# Altium schematic sheet AD8349.SchDoc
size A1
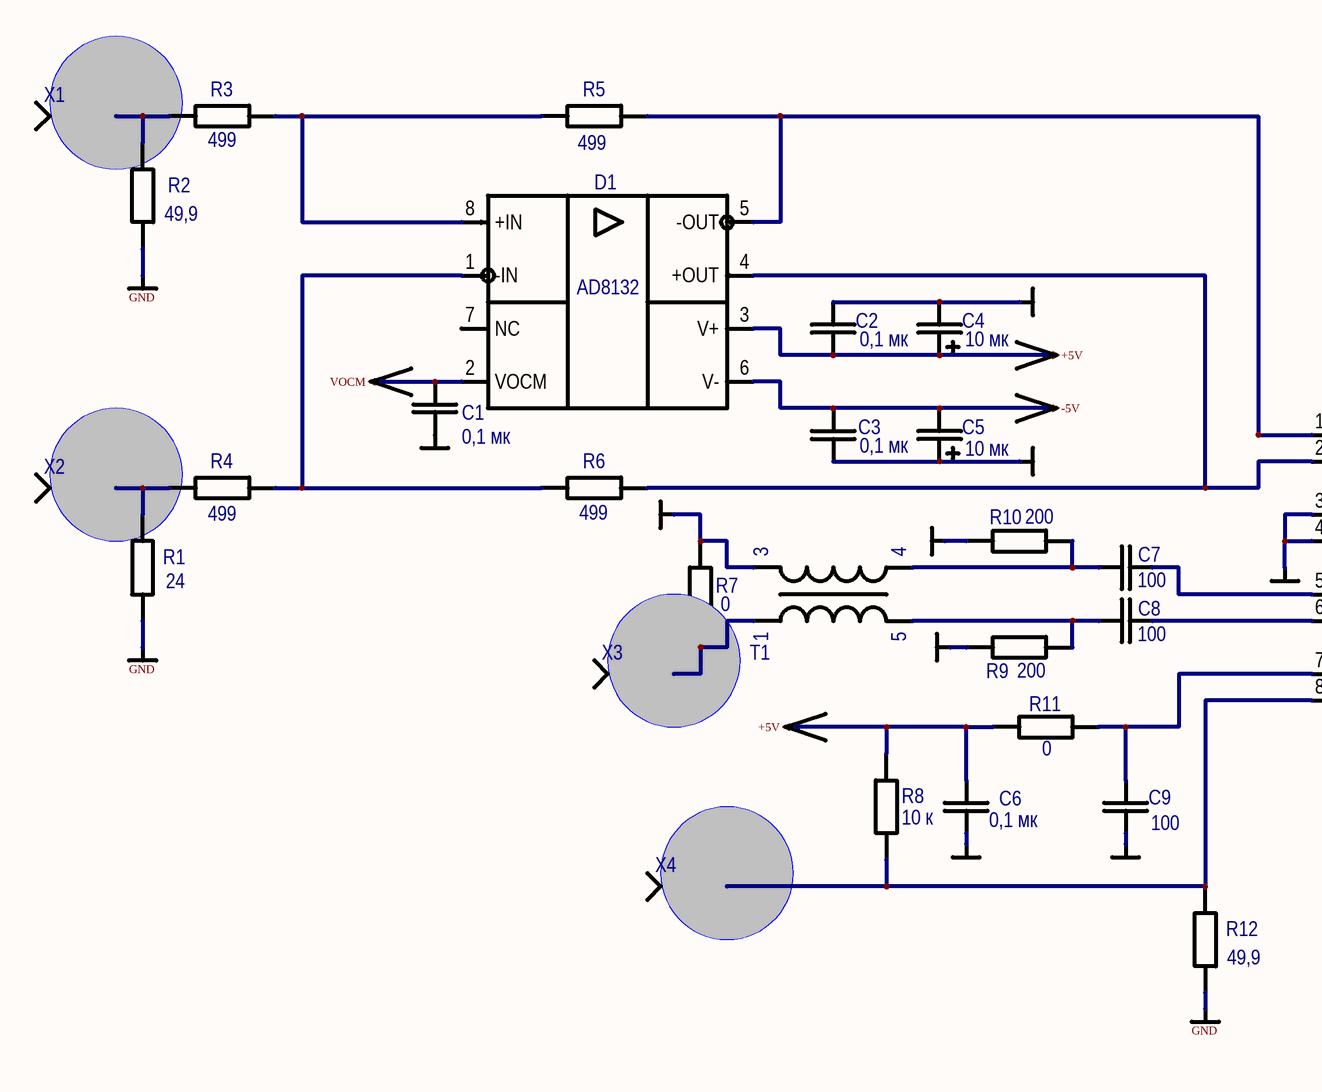
[diagram p0: AD8349.SchDoc, left]
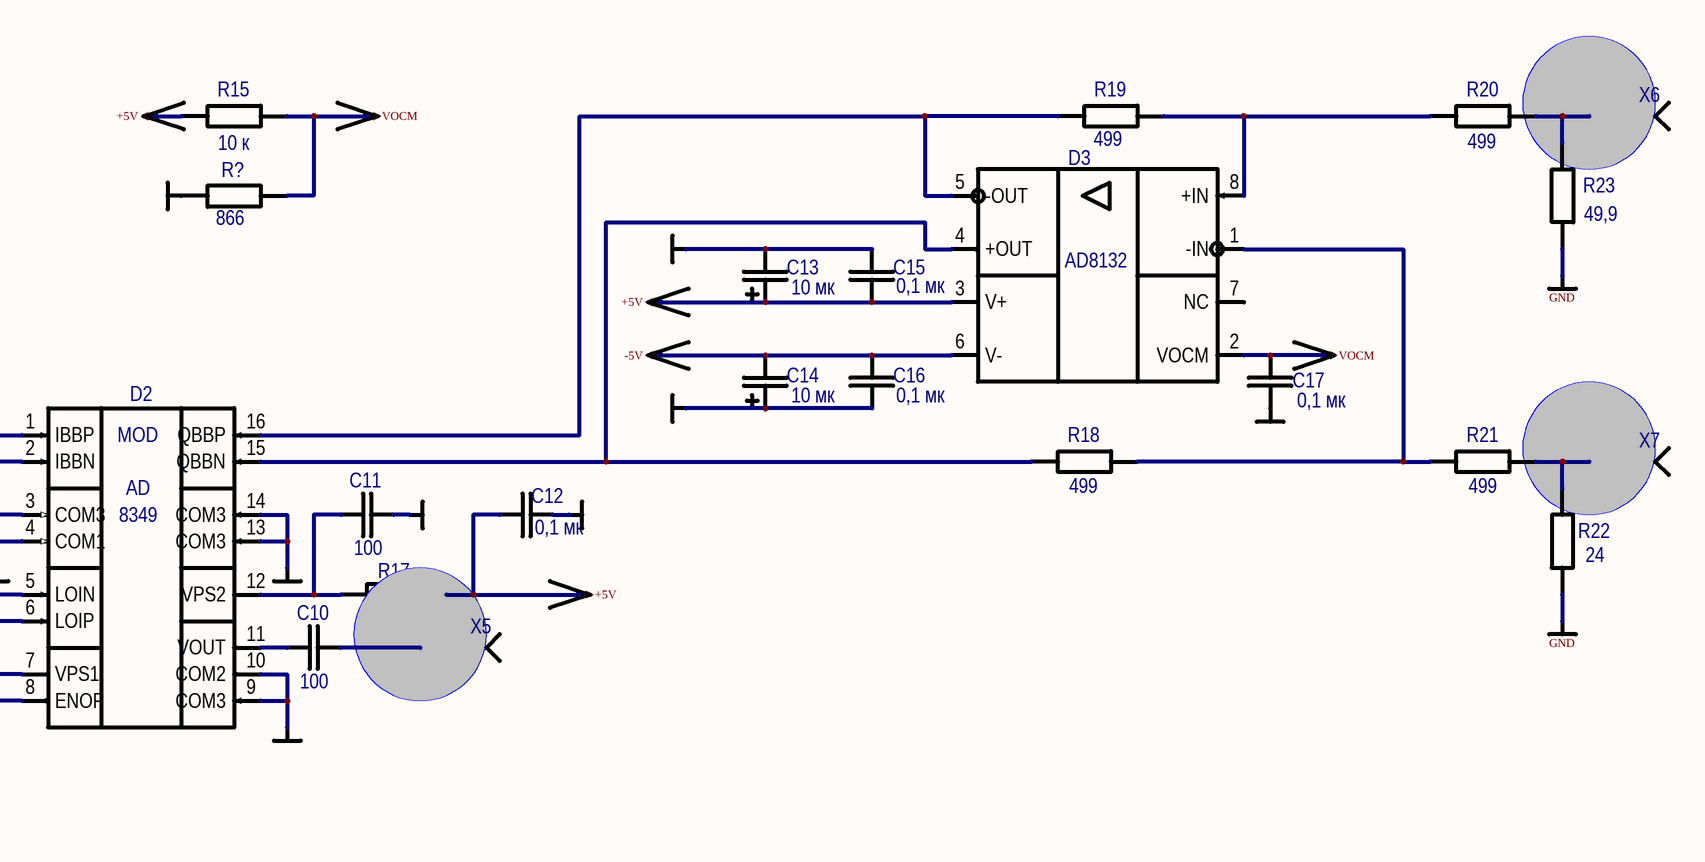
[diagram p1: AD8349.SchDoc, right]

## Parts
(Parts that share a designator on the sheet are numbered #1, #2 ... from top to bottom, then left to right.)
*  GND  (value not drawn)  (graphical)
*?#1  VCC  (value not drawn)  (graphical)
*?#2  VCC  (value not drawn)  (graphical)
*?#3  GND  (value not drawn)  (graphical)
*?#4  GND  (value not drawn)  (graphical)
*?#5  GND  (value not drawn)  (graphical)
*?#6  GND  (value not drawn)  (graphical)
*?#7  VCC  (value not drawn)  (graphical)
*?#8  VCC  (value not drawn)  (graphical)
*?#9  VCC  (value not drawn)  (graphical)
*?#10  VCC  (value not drawn)  (graphical)
*?#11  VCC  (value not drawn)  (graphical)
*?#12  VCC  (value not drawn)  (graphical)
*?#13  GND  (value not drawn)  (graphical)
*?#14  GND  (value not drawn)  (graphical)
*?#15  GND  (value not drawn)  (graphical)
*?#16  GND  (value not drawn)  (graphical)
*?#17  GND  (value not drawn)  (graphical)
*?#18  GND  (value not drawn)  (graphical)
*?#19  GND  (value not drawn)  (graphical)
*?#20  GND  (value not drawn)  (graphical)
*?#21  GND  (value not drawn)  (graphical)
*?#22  GND  (value not drawn)  (graphical)
*?#23  VCC  (value not drawn)  (graphical)
*?#24  GND  (value not drawn)  (graphical)
*?#25  GND  (value not drawn)  (graphical)
*?#26  GND  (value not drawn)  (graphical)
*?#27  VCC  (value not drawn)  (graphical)
*?#28  GND  (value not drawn)  (graphical)
*?#29  GND  (value not drawn)  (graphical)
*?#30  GND  (value not drawn)  (graphical)
*?#31  GND  (value not drawn)  (graphical)
C1  0,1 мк  [CAPC1005L]
C2  0,1 мк  [CAPC1005L]
C3  0,1 мк  [CAPC1005L]
C4  10 мк  [TC3528-1411]
C5  10 мк  [TC3528-1411]
C6  0,1 мк  [CAPC1005L]
C7  100  [CAPC1005L]
C8  100  [CAPC1005L]
C9  100  [CAPC1005L]
C10  100  [CAPC1005L]
C11  100  [CAPC1005L]
C12  0,1 мк  [CAPC1005L]
C13  10 мк  [TC3528-1411]
C14  10 мк  [TC3528-1411]
C15  0,1 мк  [CAPC1005L]
C16  0,1 мк  [CAPC1005L]
C17  0,1 мк  [CAPC1005L]
D1  AD8132  [SOIC127P600X196-8N]  (value not drawn)
D2  AD8349  [SOIC127P600X175-16N]  (value not drawn)
D3  AD8132  [SOIC127P600X196-8N]  (value not drawn)
R1  24  [RESC1005L]
R2  49,9  [RESC1608L]
R3  499  [RESC1608L]
R4  499  [RESC1608L]
R5  499  [RESC1608L]
R6  499  [RESC1608L]
R7  0  [RESC1005L]
R8  10 к  [RESC1005L]
R9  200  [RESC1005L]
R10  200  [RESC1005L]
R11  0  [RESC1005L]
R12  49,9  [RESC1608L]
R15  10 к  [RESC1005L]
R17  0  [RESC1608L]
R18  499  [RESC1608L]
R19  499  [RESC1608L]
R20  499  [RESC1608L]
R21  499  [RESC1608L]
R22  24  [RESC1005L]
R23  49,9  [RESC1608L]
R?  866  [RESC1005L]
T1  ETC1-1-13TR  [TRANS_ETC1-1-13TR]  (value not drawn)
X1  СРГ-50-751ФВ  [TP0.6X1]  (value not drawn)
X2  СРГ-50-751ФВ  [TP0.6X1]  (value not drawn)
X3  СРГ-50-751ФВ  [TP0.6X1]  (value not drawn)
X4  СРГ-50-751ФВ  [TP0.6X1]  (value not drawn)
X5  СРГ-50-751ФВ  [TP0.6X1]  (value not drawn)
X6  СРГ-50-751ФВ  [TP0.6X1]  (value not drawn)
X7  СРГ-50-751ФВ  [TP0.6X1]  (value not drawn)

## Nets
+5V: C2.2 C4.2 C6.2 C12.1 C13.2 C15.2 D1.3(V+) D3.3(V+) R8.2 R11.1 R15.1 R17.2
-5V: C3.2 C5.1 C14.1 C16.2 D1.6(V-) D3.6(V-)
GND: R1.2 R2.2 R12.2 R22.2 R23.2
NetC1_1: C1.1 C2.1 C3.1 C4.1 C5.2 C6.1 C9.1 C11.2 C12.2 C13.1 C14.2 C15.1 C16.1 C17.1 D2.3(COM3) D2.4(COM1) D2.9(COM3) D2.10(COM2) D2.13(COM3) D2.14(COM3) R7.2 R9.1 R10.1 R?.2 T1.3
VOCM: C1.2 C17.2 D1.2(VOCM) D3.2(VOCM) R15.2 R?.1
NetC7_1: C7.1 R10.2 T1.4
NetC7_2: C7.2 D2.5(LOIN)
NetC8_1: C8.1 R9.2 T1.5
NetC8_2: C8.2 D2.6(LOIP)
NetC9_2: C9.2 D2.7(VPS1) R11.2
NetC10_1: C10.1 D2.11(VOUT)
NetC10_2: C10.2 X5.1
NetC11_1: C11.1 D2.12(VPS2) R17.1
NetD1_1: D1.1(-IN) R4.2 R6.1
NetD1_4: D1.4(+OUT) D2.2(IBBN) R6.2
NetD1_5: D1.5(-OUT) D2.1(IBBP) R5.2
NetD1_8: D1.8(+IN) R3.2 R5.1
NetD2_8: D2.8(ENOP) R8.1 R12.1 X4.1
NetD2_15: D2.15(QBBN) D3.4(+OUT) R18.1
NetD2_16: D2.16(QBBP) D3.5(-OUT) R19.1
NetD3_1: D3.1(-IN) R18.2 R21.1
NetD3_8: D3.8(+IN) R19.2 R20.1
NetR1_1: R1.1 R4.1 X2.1
NetR2_1: R2.1 R3.1 X1.1
NetR7_1: R7.1 T1.1 X3.1
NetR20_2: R20.2 R23.1 X6.1
NetR21_2: R21.2 R22.1 X7.1

Not connected (* = marked no-connect by the designer): D1 7(NC); D3 7(NC)

## Notes on the sheet
- Title
- Size:
- Date:
- File:
- A1
- Number:
- Time:
- Revision:
- Sheet
- of
- (in symbol AD8349) MOD; AD; 8349

## Library data of the parts
* *?#3-*?#6 *?#13-*?#22 *?#24-*?#26 *?#28-*?#31 = GND: Корпус ЕСКД. Для "наложения" на штатный Power Bar
*?#1 *?#2 *?#7-*?#12 *?#23 *?#27 = VCC: Порт ЕСКД. Для "наложения" на штатный Power Bar
C1-C3 C15-C17 = i6124B5A0870D0000001: Чип-конденсатор; ManufacturerPartNumber: 0402 X7R 0,1 мкФ ±10 % 16 В; Name: 0402; Power/Voltage: 16 В; TKE/TKC: {TKE/TKC}; Tolerance: ±10 %; PCADSymbol: C; PCADLibrary: PASSIV.LIB; BCPId: *; Manufacturer: *; Type: Конденсатор; Value: 0,1 мк; ImKey: i6124B5A0870D0000001; PCADType: C0402; PCADPattern: C0402
C4 C5 C13 C14 = i6124B5A087030000003: Танталовый конденсатор; ManufacturerPartNumber: К53-67-16 В-10 мкФ ±10 %; Power/Voltage: 16 В; Tolerance: ±10 %; PCADSymbol: TAJ; PCADLibrary: PASSIV.LIB; TU/GOST: АЖЯР.673546.006 ТУ; BCPId: *; Manufacturer: *; Name: TAJB; TKE/TKC: *; Type: Конденсатор; Value: 10 мк; ImKey: i6124B5A087030000003; PCADType: TAJB; PCADPattern: TAJB
C6 C12 = i6124B5A087044000001: Чип-конденсатор; ManufacturerPartNumber: 0402 X5R 0,1 мкФ ±10 % 10 В; Name: 0402; Power/Voltage: 10 В; TKE/TKC: {TKE/TKC}; Tolerance: ±10 %; PCADSymbol: C; PCADLibrary: PASSIV.LIB; BCPId: *; Manufacturer: *; Type: Конденсатор; Value: 0,1 мк; ImKey: i6124B5A087044000001; PCADType: C0402; PCADPattern: C0402
C7-C11 = i6124B5A087471000001: Чип-конденсатор; ManufacturerPartNumber: 0402 NP0 100 пФ ±5 % 50 В; Name: 0402; Power/Voltage: 50 В; TKE/TKC: {TKE/TKC}; Tolerance: ±5 %; PCADSymbol: C; PCADLibrary: PASSIV.LIB; BCPId: *; Manufacturer: *; Type: Конденсатор; Value: 100; ImKey: i6124B5A087471000001; PCADType: C0402; PCADPattern: C0402
D1 D3 = AD8132: Manufacturer: Analog Devices; Type: Микросхема; BCPId: *; Name: *; Package: SO-8; ManufacturerPartNumber: AD8132
D2 = AD8349: WIDEBAND DIRECT QUADRATURE MODULATOR, 100 - 6000 MHz; Manufacturer: Hittite; Type: Микросхема; SymAuthor: Чернова Ю.Г.; Package: LP4E; ManufacturerPartNumber: AD8349
R1 R22 = i6124B5A0876CB000013: Чип-резистор; ManufacturerPartNumber: CR0402-JW-240GLF Bourns; Name: 0402; Tolerance: ±5 %; PCADSymbol: R; PCADLibrary: PASSIV.LIB; BCPId: *; Manufacturer: *; Type: Резистор; Value: 24; ImKey: i6124B5A0876CB000013; PCADType: R0402; PCADPattern: R0402
R2 R12 R23 = i6124B5A08741A00000E: Чип-резистор; ManufacturerPartNumber: Р1-12-0,1-49,9 Ом ±1 % - Т; Name: 0603; Tolerance: ±1 %; Power/Voltage: 0,1 Вт; TU/GOST: АЛЯР.434110.005 ТУ; BCPId: *; Manufacturer: *; Type: Резистор; Value: 49,9; ImKey: i6124B5A08741A00000E
R3-R6 R18-R21 = i6124B5A08741A00002A: Чип-резистор; ManufacturerPartNumber: Р1-12-0,1-499 Ом ±1 % - Т; Name: 0603; Tolerance: ±1 %; Power/Voltage: 0,1 Вт; TU/GOST: АЛЯР.434110.005 ТУ; BCPId: *; Manufacturer: *; Type: Резистор; Value: 499; ImKey: i6124B5A08741A00002A
R7 R11 = i6124B5A08703F00000B: Чип-резистор; ManufacturerPartNumber: 0402 0 Ом; Name: 0402; Tolerance: {Tolerance}; Power/Voltage: 0,063 Вт; BCPId: *; Manufacturer: *; Type: Резистор; Value: 0; ImKey: i6124B5A08703F00000B
R8 = i6124B5A08703F000005: Чип-резистор; ManufacturerPartNumber: 0402 10 кОм ±5 %; Name: 0402; Tolerance: ±5 %; Power/Voltage: 0,063 Вт; BCPId: *; Manufacturer: *; Type: Резистор; Value: 10 к; ImKey: i6124B5A08703F000005
R9 R10 = i6124B5A08703F00000A: Чип-резистор; ManufacturerPartNumber: 0402 200 Ом ±5 %; Name: 0402; Tolerance: ±5 %; Power/Voltage: 0,063 Вт; BCPId: *; Manufacturer: *; Type: Резистор; Value: 200; ImKey: i6124B5A08703F00000A
R15 = i6124B5A0870A6000022: Чип-резистор; ManufacturerPartNumber: Р1-12-0,062-10 кОм ±5 % - Т; Name: 0402; Tolerance: ±5 %; Power/Voltage: 0,062 Вт; TU/GOST: АЛЯР.434110.005 ТУ; BCPId: *; Manufacturer: *; Type: Резистор; Value: 10 к; ImKey: i6124B5A0870A6000022
R17 = i6124B5A08711900002C: Чип-резистор; ManufacturerPartNumber: 0603 0 Ом; Name: 0603; Tolerance: {Tolerance}; Power/Voltage: 0,063 Вт; BCPId: *; Manufacturer: *; Type: Резистор; Value: 0; ImKey: i6124B5A08711900002C
R? = i6124B5A0876CC000035: Чип-резистор; ManufacturerPartNumber: CR0402-FX-8660GLF Bourns; Name: 0402; Tolerance: ±1 %; PCADSymbol: R; PCADLibrary: PASSIV.LIB; BCPId: *; Manufacturer: *; Type: Резистор; Value: 866; ImKey: i6124B5A0876CC000035; PCADType: R0402; PCADPattern: R0402
T1 = ETC1-1-13TR: Трансформатор; Manufacturer*: Mini-Circuits; Power/Voltage*: 0.25Вт; BCPId: *; Type: Трансформатор; ManufacturerPartNumber: ETC1-1-13TR; Package: SM-22
X1-X7 = СРГ-50-751ФВ: Переход; TU/GOST: ВР0.364.049 ТУ; BCPId: *; Name: *; ManufacturerPartNumber: СРГ-50-751ФВ; Type: Переход